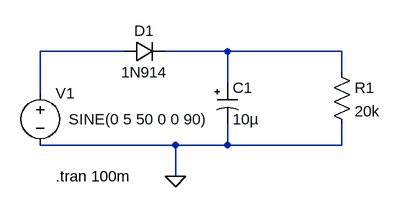
[diagram p0: schematic lab2_1-napiv_period_vipramlach.asc]
lab2_1-napiv_period_vipramlach.asc, the LTspice schematic file:
Version 4
SHEET 1 880 680
WIRE 176 80 48 80
WIRE 336 80 240 80
WIRE 512 80 336 80
WIRE 512 112 512 80
WIRE 336 128 336 80
WIRE 48 144 48 80
WIRE 256 224 48 224
WIRE 336 224 336 192
WIRE 336 224 256 224
WIRE 512 224 512 192
WIRE 512 224 336 224
WIRE 256 272 256 224
FLAG 256 272 0
SYMBOL voltage 48 128 R0
WINDOW 3 44 56 Left 2
WINDOW 123 0 0 Left 2
WINDOW 39 0 0 Left 2
SYMATTR Value SINE(0 5 50 0 0 90)
SYMATTR InstName V1
SYMBOL diode 176 96 R270
WINDOW 0 32 32 VTop 2
WINDOW 3 0 32 VBottom 2
SYMATTR InstName D1
SYMATTR Value 1N914
SYMBOL polcap 320 128 R0
SYMATTR InstName C1
SYMATTR Value 10µ
SYMBOL res 496 96 R0
SYMATTR InstName R1
SYMATTR Value 20k
TEXT 72 272 Left 2 !.tran 100m

The netlist it stands for:
* lab2_1-napiv_period_vipramlach.asc
V1 N001 0 SINE(0 5 50 0 0 90)
D1 N001 N002 1N914
C1 N002 0 10µ
R1 N002 0 20k
.model D D
.lib standard.dio
.tran 100m
.backanno
.end